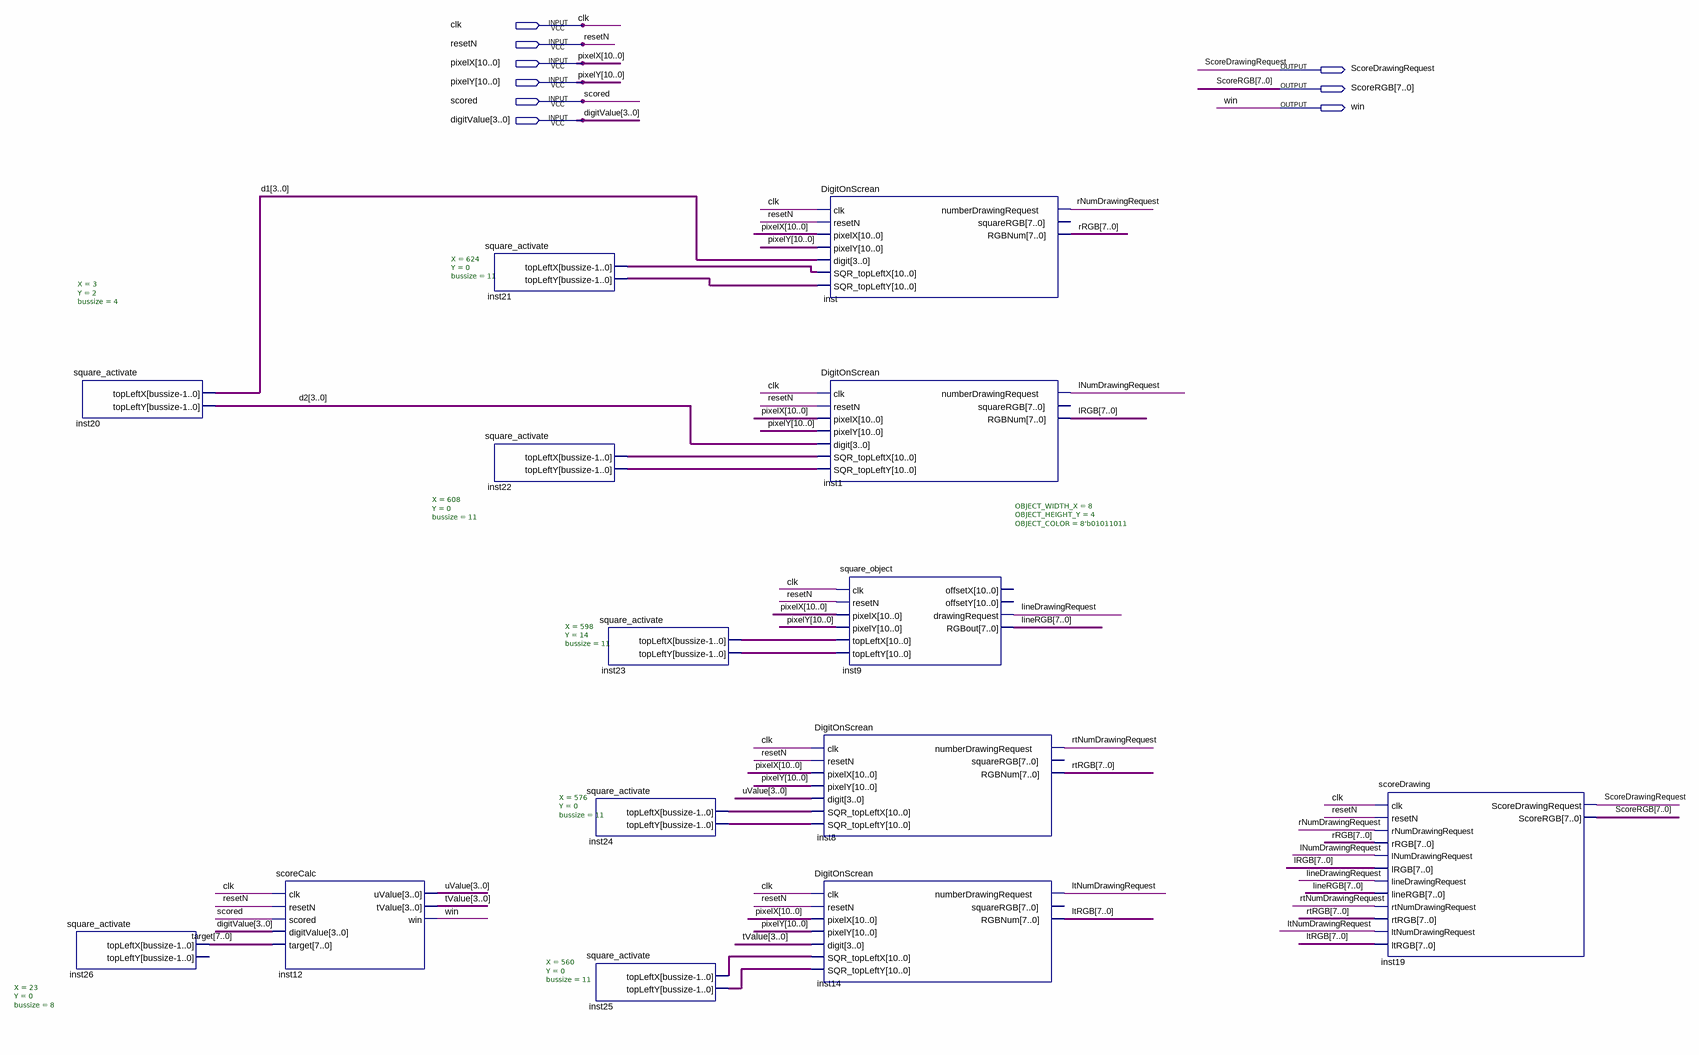
[diagram p0: schematic sheet]
// Quartus schematic Score.bdf as structural Verilog: 14 symbols, 9 pins
module Score (
  input  clk,
  input  resetN,
  input  [10:0] pixelX,
  input  [10:0] pixelY,
  input  scored,
  input  [3:0] digitValue,
  output ScoreDrawingRequest,
  output [7:0] ScoreRGB,
  output win
);

  wire lineDrawingRequest, lNumDrawingRequest, ltNumDrawingRequest, rNumDrawingRequest, rtNumDrawingRequest;
  wire [3:0] d1, d2, tValue, uValue;
  wire [7:0] lineRGB, lRGB, ltRGB, rRGB, rtRGB, target;
  wire [10:0] inst21_topleftx, inst21_toplefty, inst22_topleftx, inst22_toplefty, inst23_topleftx,
       inst23_toplefty, inst24_topleftx, inst24_toplefty, inst25_topleftx, inst25_toplefty;

  square_activate #(.X(3), .Y(2), .bussize(4)) inst20 (.topLeftX(d1), .topLeftY(d2));
  square_activate #(.X(23), .Y(0), .bussize(8)) inst26 (.topLeftX(target));  // open: topLeftY
  scoreCalc inst12 (
    .clk(clk), .resetN(resetN), .scored(scored), .digitValue(digitValue), .target(target), .uValue(uValue),
    .tValue(tValue), .win(win));
  square_activate #(.X(624), .Y(0), .bussize(11)) inst21 (.topLeftX(inst21_topleftx), .topLeftY(inst21_toplefty));
  square_activate #(.X(608), .Y(0), .bussize(11)) inst22 (.topLeftX(inst22_topleftx), .topLeftY(inst22_toplefty));
  square_activate #(.X(598), .Y(14), .bussize(11)) inst23 (.topLeftX(inst23_topleftx), .topLeftY(inst23_toplefty));
  square_activate #(.X(576), .Y(0), .bussize(11)) inst24 (.topLeftX(inst24_topleftx), .topLeftY(inst24_toplefty));
  square_activate #(.X(560), .Y(0), .bussize(11)) inst25 (.topLeftX(inst25_topleftx), .topLeftY(inst25_toplefty));
  DigitOnScrean inst8 (
    .clk(clk), .resetN(resetN), .pixelX(pixelX), .pixelY(pixelY), .digit(uValue),
    .SQR_topLeftX(inst24_topleftx), .SQR_topLeftY(inst24_toplefty),
    .numberDrawingRequest(rtNumDrawingRequest), .RGBNum(rtRGB));  // open: squareRGB
  DigitOnScrean inst14 (
    .clk(clk), .resetN(resetN), .pixelX(pixelX), .pixelY(pixelY), .digit(tValue),
    .SQR_topLeftX(inst25_topleftx), .SQR_topLeftY(inst25_toplefty),
    .numberDrawingRequest(ltNumDrawingRequest), .RGBNum(ltRGB));  // open: squareRGB
  DigitOnScrean inst (
    .clk(clk), .resetN(resetN), .pixelX(pixelX), .pixelY(pixelY), .digit(d1), .SQR_topLeftX(inst21_topleftx),
    .SQR_topLeftY(inst21_toplefty), .numberDrawingRequest(rNumDrawingRequest), .RGBNum(rRGB));  // open: squareRGB
  DigitOnScrean inst1 (
    .clk(clk), .resetN(resetN), .pixelX(pixelX), .pixelY(pixelY), .digit(d2), .SQR_topLeftX(inst22_topleftx),
    .SQR_topLeftY(inst22_toplefty), .numberDrawingRequest(lNumDrawingRequest), .RGBNum(lRGB));  // open: squareRGB
  square_object #(.OBJECT_WIDTH_X(8), .OBJECT_HEIGHT_Y(4), .OBJECT_COLOR(8'b01011011)) inst9 (
    .clk(clk), .resetN(resetN), .pixelX(pixelX), .pixelY(pixelY), .topLeftX(inst23_topleftx),
    .topLeftY(inst23_toplefty), .drawingRequest(lineDrawingRequest), .RGBout(lineRGB));  // open: offsetX, offsetY
  scoreDrawing inst19 (
    .clk(clk), .resetN(resetN), .rNumDrawingRequest(rNumDrawingRequest), .rRGB(rRGB),
    .lNumDrawingRequest(lNumDrawingRequest), .lRGB(lRGB), .lineDrawingRequest(lineDrawingRequest),
    .lineRGB(lineRGB), .rtNumDrawingRequest(rtNumDrawingRequest), .rtRGB(rtRGB),
    .ltNumDrawingRequest(ltNumDrawingRequest), .ltRGB(ltRGB), .ScoreDrawingRequest(ScoreDrawingRequest),
    .ScoreRGB(ScoreRGB));
endmodule
